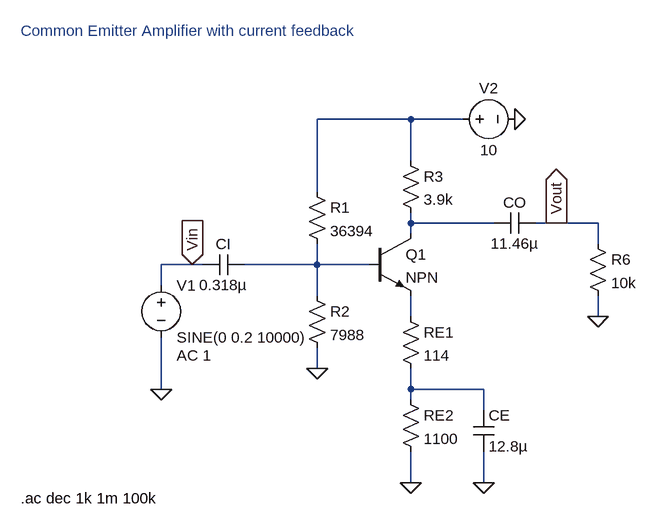
[diagram p0: schematic CommonEmitterAmplifier_currentfeedback.asc]
CommonEmitterAmplifier_currentfeedback.asc, the LTspice schematic file:
Version 4
SHEET 1 880 680
WIRE 432 -144 288 -144
WIRE 512 -144 432 -144
WIRE 432 -80 432 -144
WIRE 288 -32 288 -144
WIRE 432 16 432 0
WIRE 560 16 432 16
WIRE 656 16 624 16
WIRE 720 16 656 16
WIRE 432 32 432 16
WIRE 720 48 720 16
WIRE 96 80 48 80
WIRE 112 80 96 80
WIRE 288 80 288 48
WIRE 288 80 176 80
WIRE 368 80 288 80
WIRE 48 112 48 80
WIRE 288 128 288 80
WIRE 432 160 432 128
WIRE 720 160 720 128
WIRE 288 240 288 208
WIRE 48 272 48 192
WIRE 432 272 432 240
WIRE 544 272 432 272
WIRE 432 288 432 272
WIRE 544 304 544 272
WIRE 432 416 432 368
WIRE 544 416 544 368
FLAG 48 272 0
FLAG 432 416 0
FLAG 544 416 0
FLAG 288 240 0
FLAG 720 160 0
FLAG 592 -144 0
FLAG 96 80 Vin
IOPIN 96 80 In
FLAG 656 16 Vout
IOPIN 656 16 Out
SYMBOL res 272 -48 R0
SYMATTR InstName R1
SYMATTR Value 36394
SYMBOL res 272 112 R0
SYMATTR InstName R2
SYMATTR Value 7988
SYMBOL voltage 48 96 R0
WINDOW 123 24 124 Left 2
WINDOW 39 0 0 Left 0
SYMATTR Value2 AC 1
SYMATTR InstName V1
SYMATTR Value SINE(0 0.2 10000)
SYMBOL cap 176 64 R90
WINDOW 0 0 32 VBottom 2
WINDOW 3 32 32 VTop 2
SYMATTR InstName CI
SYMATTR Value 0.318µ
SYMBOL res 416 -96 R0
SYMATTR InstName R3
SYMATTR Value 3.9k
SYMBOL res 416 144 R0
SYMATTR InstName RE1
SYMATTR Value 114
SYMBOL res 416 272 R0
SYMATTR InstName RE2
SYMATTR Value 1100
SYMBOL res 704 32 R0
SYMATTR InstName R6
SYMATTR Value 10k
SYMBOL cap 624 0 R90
WINDOW 0 0 32 VBottom 2
WINDOW 3 32 32 VTop 2
SYMATTR InstName CO
SYMATTR Value 11.46µ
SYMBOL cap 528 304 R0
SYMATTR InstName CE
SYMATTR Value 12.8µ
SYMBOL npn 368 32 R0
SYMATTR InstName Q1
SYMBOL voltage 496 -144 R270
WINDOW 0 32 56 VTop 2
WINDOW 3 -32 56 VBottom 2
WINDOW 123 0 0 Left 0
WINDOW 39 0 0 Left 0
SYMATTR InstName V2
SYMATTR Value 10
TEXT -168 -280 Left 2 ;Common Emitter Amplifier with current feedback
TEXT -168 440 Left 2 !.ac dec 1k 1m 100k

The netlist it stands for:
* CommonEmitterAmplifier_currentfeedback.asc
R1 N001 N003 36394
R2 N003 0 7988
V1 Vin 0 SINE(0 0.2 10000) AC 1
CI N003 Vin 0.318µ
R3 N001 N002 3.9k
RE1 N004 N005 114
RE2 N005 0 1100
R6 Vout 0 10k
CO Vout N002 11.46µ
CE N005 0 12.8µ
Q1 N002 N003 N004 0 NPN
V2 N001 0 10
.model NPN NPN
.model PNP PNP
.lib standard.bjt
* Common Emitter Amplifier with current feedback
.ac dec 1k 1m 100k
.backanno
.end